# EAGLE design untitled (EAGLE 8.1.0)
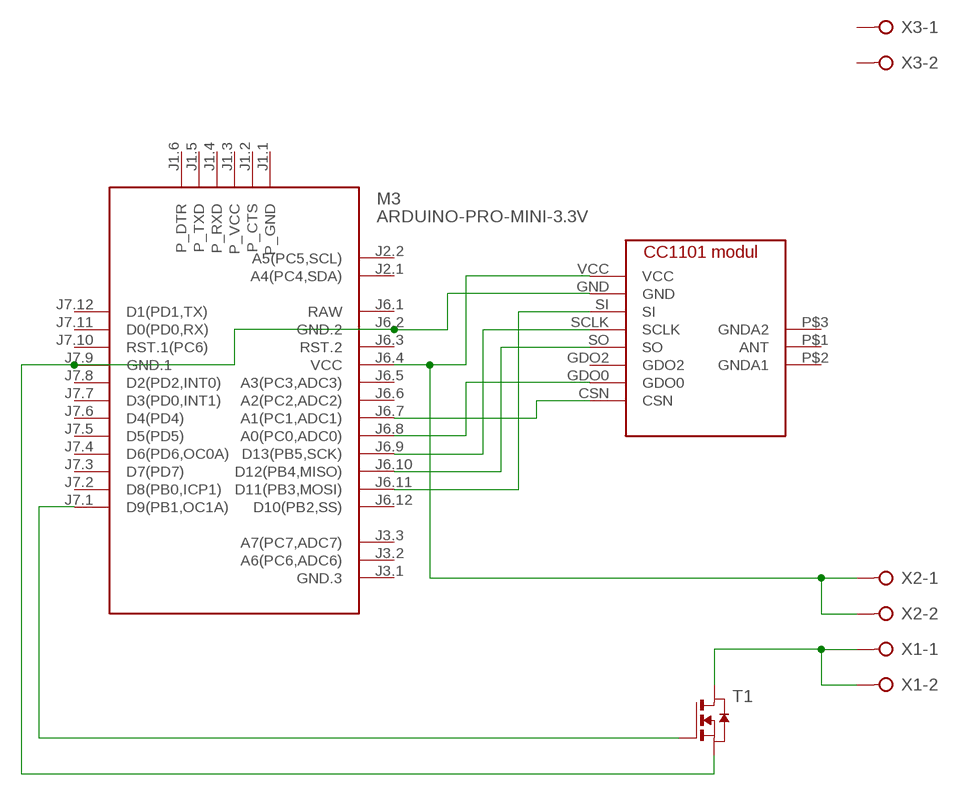
[diagram p0: schematic, sheet 1]

## Parts
M3  ARDUINO-PRO-MINI-3.3V  [ARDUINO-PRO-MINI]
T1  NMOSSOT23  [SOT-23]
U$1  CC1101-MODULEPFOSTEN  [PFOSTEN]
X1  W237-02P  [W237-132]
X2  W237-02P  [W237-132]
X3  W237-02P  [W237-132]

## Nets
N$1: M3.J6.4(VCC) U$1.VCC X2.1 X2.2
N$2: M3.J6.2(GND.2) M3.J7.9(GND.1) T1.2(S) U$1.GND
N$3: M3.J6.7(A1(PC1,ADC1)) U$1.CSN
N$4: M3.J6.11(D11(PB3,MOSI)) U$1.SI
N$5: M3.J6.10(D12(PB4,MISO)) U$1.SO
N$6: M3.J6.9(D13(PB5,SCK)) U$1.SCLK
N$7: M3.J6.8(A0(PC0,ADC0)) U$1.GDO0
N$8: M3.J7.1(D9(PB1,OC1A)) T1.3(G)
N$9: T1.1(D) X1.1 X1.2
Unconnected: M3.J1.1(P_GND) M3.J1.2(P_CTS) M3.J1.3(P_VCC) M3.J1.4(P_RXD) M3.J1.5(P_TXD) M3.J1.6(P_DTR) M3.J2.1(A4(PC4,SDA)) M3.J2.2(A5(PC5,SCL)) M3.J3.1(GND.3) M3.J3.2(A6(PC6,ADC6)) M3.J3.3(A7(PC7,ADC7)) M3.J6.3(RST.2) M3.J6.5(A3(PC3,ADC3)) M3.J6.6(A2(PC2,ADC2)) M3.J6.12(D10(PB2,SS)) M3.J7.2(D8(PB0,ICP1)) M3.J7.3(D7(PD7)) M3.J7.4(D6(PD6,OC0A)) M3.J7.5(D5(PD5)) M3.J7.6(D4(PD4)) M3.J7.7(D3(PD0,INT1)) M3.J7.8(D2(PD2,INT0)) M3.J7.10(RST.1(PC6)) M3.J7.11(D0(PD0,RX)) M3.J7.12(D1(PD1,TX)) U$1.GDO2 U$1.P$1(ANT) U$1.P$2(GNDA1) U$1.P$3(GNDA2) X3.1 X3.2

## Power pins joined to a net without a drawn wire
RAW: M3.J6.1(RAW)

## Library data of the parts
M3 = diy-modules:ARDUINO-PRO-MINI-*: Arduino Pro Mini and compatible devices More details available here: https://www.arduino.cc/en/Main/ArduinoBoardProMini Click here to find device on ebay.com <http://www.ebay.com/sch/arduino+pro+mini>
T1 = zetex:NMOSSOT23: MOS FET; OC_FARNELL: unknown; OC_NEWARK: unknown
U$1 = cc1101:CC1101-MODULE
X1-X3 = con-wago-508:W237-02P: WAGO SREW CLAMP; OC_FARNELL: unknown; OC_NEWARK: unknown

## Net classes
0 default: clearance 0.205 mm

## Board
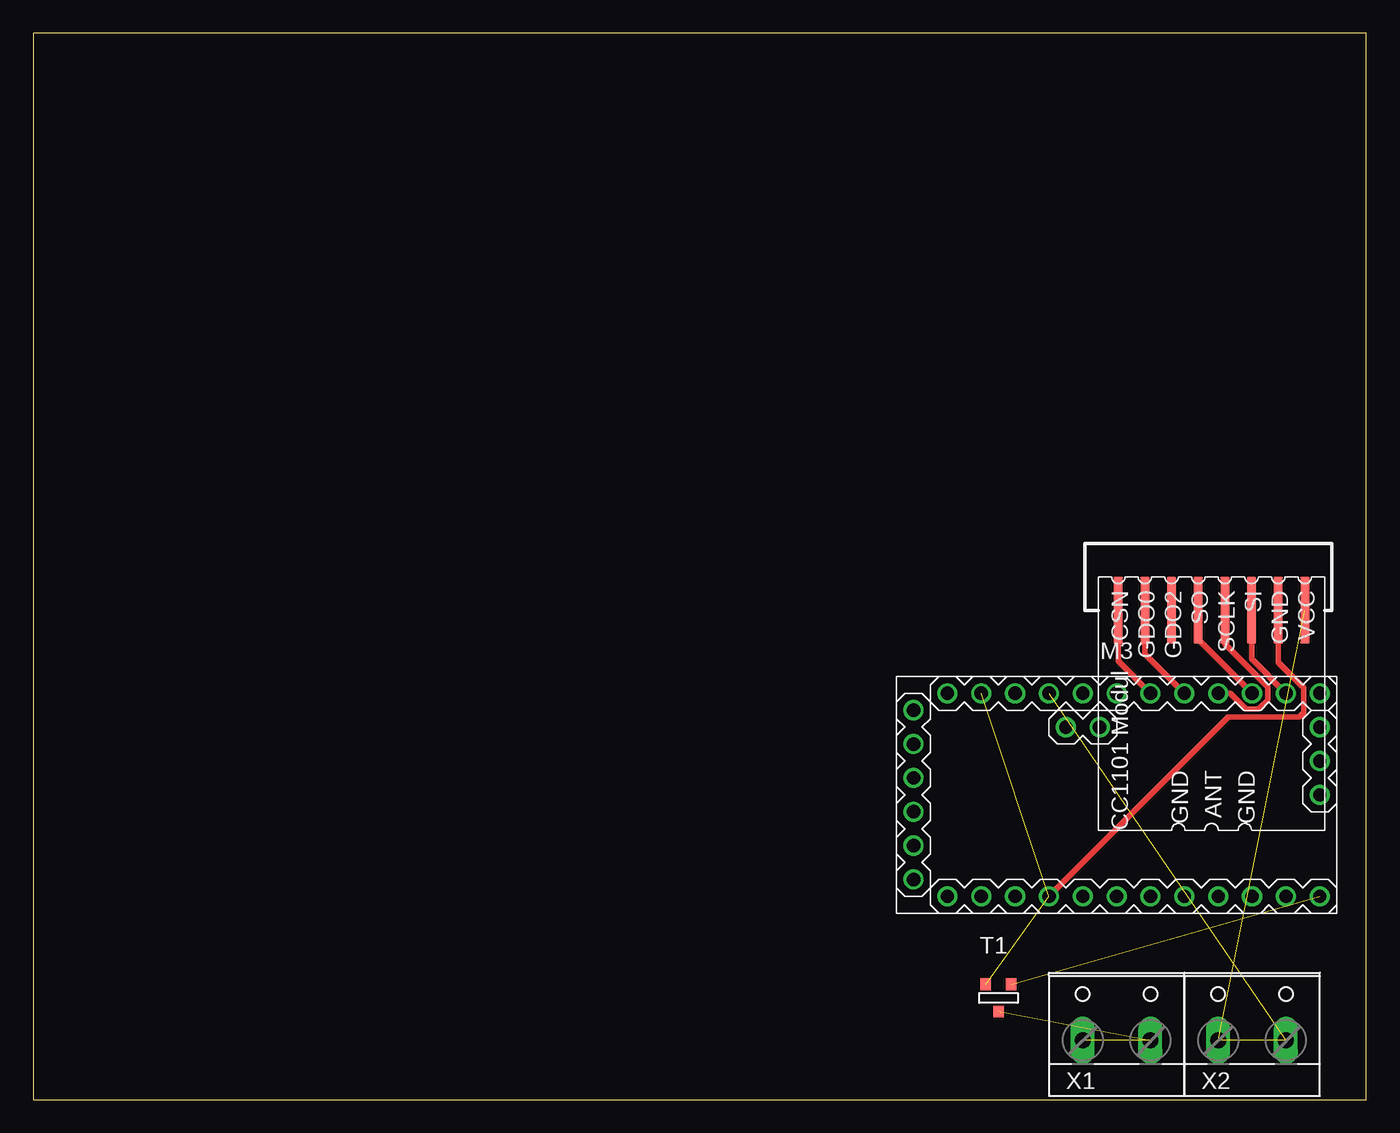
[diagram p1: board, top side]

Size 100 x 80 mm. Coordinates in mm from the lower left corner, seen from the top.
Outline: 0,0 100,0 100,80 0,80 0,0
Copper layers (1*16): Top 0.035mm / dielectric 1.5mm / Bottom 0.035mm
Design rules "untitled": minimum track width 10mil, minimum drill 24mil, track to track 0.205mm, track to pad 0.205mm, pad to pad 0.205mm, via to via 0.205mm, smd to smd 8mil, copper to edge 40mil, drill to drill 8mil, minimum pad ring 10mil, minimum via ring 8mil, stop-mask expansion 4mil, vias tented up to drill 0mil, thermal gap 10mil

### Footprints (pad centres in the part's own frame; a part is rotated, then mirrored left to right if it is on the bottom)
ARDUINO-PRO-MINI = drill 1: J1.1 -15.24,6.35; J1.2 -15.24,3.81; J1.3 -15.24,1.27; J1.4 -15.24,-1.27; J1.5 -15.24,-3.81; J1.6 -15.24,-6.35; J2.1 -1.27,5.08; J2.2 -3.81,5.08; J3.1 15.24,0; J3.2 15.24,2.54; J3.3 15.24,5.08; J6.1 -12.7,7.62; J6.2 -10.16,7.62; J6.3 -7.62,7.62; J6.4 -5.08,7.62; J6.5 -2.54,7.62; J6.6 0,7.62; J6.7 2.54,7.62; J6.8 5.08,7.62; J6.9 7.62,7.62; J6.10 10.16,7.62; J6.11 12.7,7.62; J6.12 15.24,7.62; J7.1 15.24,-7.62; J7.2 12.7,-7.62; J7.3 10.16,-7.62; J7.4 7.62,-7.62; J7.5 5.08,-7.62; J7.6 2.54,-7.62; J7.7 0,-7.62; J7.8 -2.54,-7.62; J7.9 -5.08,-7.62; J7.10 -7.62,-7.62; J7.11 -10.16,-7.62; J7.12 -12.7,-7.62
SOT-23 = smd 0.787 x 0.889: 1 0.025,-1.016; 2 -0.94,1.016; 3 0.991,1.016
PFOSTEN = smd 5 x 0.7: CSN -7.5,-7.5; GDO0 -7.5,-5.5; GDO2 -7.5,-3.5; GND -7.5,4.5; SCLK -7.5,0.5; SI -7.5,2.5; SO -7.5,-1.5; VCC -7.5,6.5 | smd 0 x 0: P$1 -1.5,6; P$2 0,6; P$3 2,6
W237-132 = drill 1.194 long: 1 -2.54,-0.635; 2 2.54,-0.635

### Placement (x,y rotation side)
M3  81.28,22.86 0 top
T1  72.39,7.62 0 top
U$1  88.9,29.21 270 top
X1  81.28,5.08 0 top
X2  91.44,5.08 0 top
X3  12.7,-55.88 0 top  (outside the outline)

### Tracks (layer width: path | path; a pad name or v marks a point on that pad's centre or on a via)
N$1  (3 unrouted)
N$2  (2 unrouted)
  Top 0.406: M3.J7.9 89.67,28.71 94.97,28.71 95.31,29.04 95.31,30.88 93.4,32.79 U$1.GND
N$3
  Top 0.406: M3.J6.7 81.4,32.9 U$1.CSN
N$4
  Top 0.406: M3.J6.11 91.4,33.06 U$1.SI
N$5
  Top 0.406: M3.J6.10 87.4,34.52 U$1.SO
N$6
  Top 0.406: M3.J6.9 89.8,30.48 90.96,29.32 91.92,29.32 92.6,30 92.6,30.96 89.4,34.16 U$1.SCLK
N$7
  Top 0.406: M3.J6.8 83.4,33.44 U$1.GDO0
N$8  (1 unrouted)
N$9  (2 unrouted)